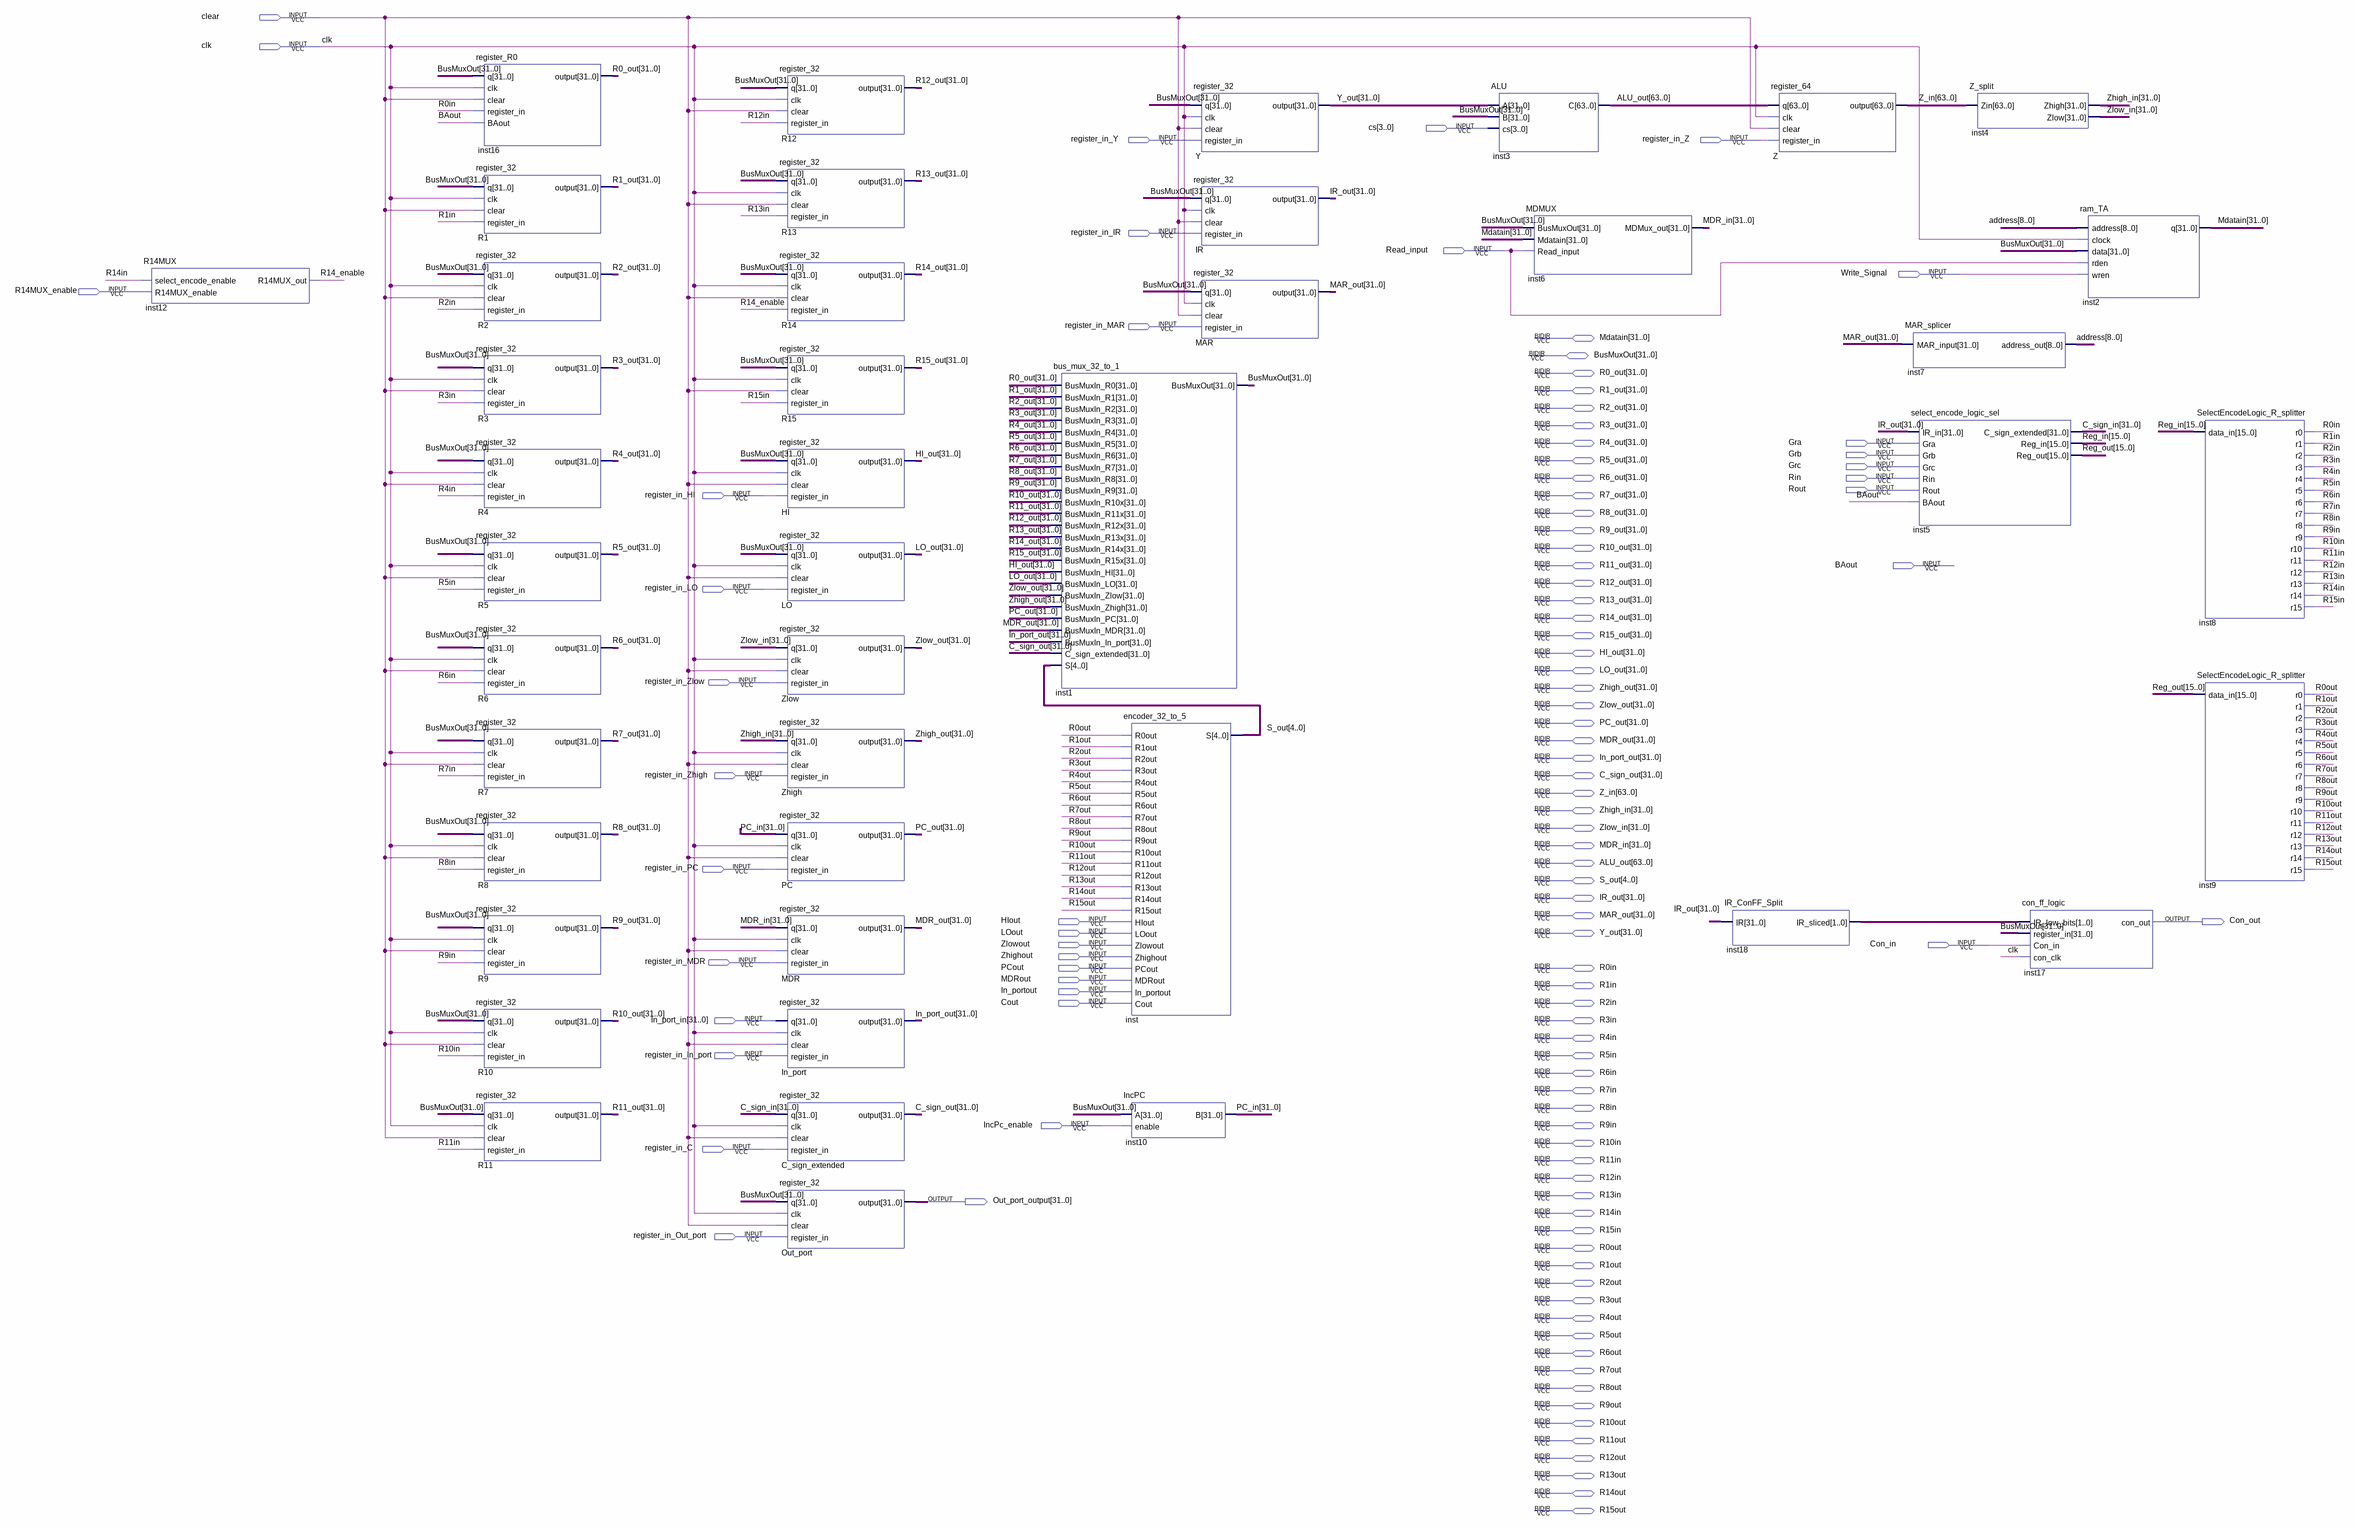
[diagram p0: schematic sheet]
// Quartus schematic phase2.bdf as structural Verilog: 43 symbols, 105 pins
module phase2 (
  input  clear,
  input  clk,
  input  [3:0] cs,
  input  register_in_Y,
  input  register_in_Z,
  input  register_in_IR,
  input  Read_input,
  input  Write_Signal,
  input  R14MUX_enable,
  input  register_in_MAR,
  input  Gra,
  input  Grb,
  input  Grc,
  input  Rin,
  input  Rout,
  input  register_in_HI,
  input  BAout,
  input  register_in_LO,
  input  register_in_Zlow,
  input  register_in_Zhigh,
  input  register_in_PC,
  input  HIout,
  input  LOout,
  input  Zlowout,
  input  Con_in,
  input  Zhighout,
  input  register_in_MDR,
  input  PCout,
  input  MDRout,
  input  In_portout,
  input  Cout,
  input  [31:0] In_port_in,
  input  register_in_In_port,
  input  IncPc_enable,
  input  register_in_C,
  input  register_in_Out_port,
  inout  [31:0] Mdatain,
  inout  [31:0] BusMuxOut,
  inout  [31:0] R0_out,
  inout  [31:0] R1_out,
  inout  [31:0] R2_out,
  inout  [31:0] R3_out,
  inout  [31:0] R4_out,
  inout  [31:0] R5_out,
  inout  [31:0] R6_out,
  inout  [31:0] R7_out,
  inout  [31:0] R8_out,
  inout  [31:0] R9_out,
  inout  [31:0] R10_out,
  inout  [31:0] R11_out,
  inout  [31:0] R12_out,
  inout  [31:0] R13_out,
  inout  [31:0] R14_out,
  inout  [31:0] R15_out,
  inout  [31:0] HI_out,
  inout  [31:0] LO_out,
  inout  [31:0] Zhigh_out,
  inout  [31:0] Zlow_out,
  inout  [31:0] PC_out,
  inout  [31:0] MDR_out,
  inout  [31:0] In_port_out,
  inout  [31:0] C_sign_out,
  inout  [63:0] Z_in,
  inout  [31:0] Zhigh_in,
  inout  [31:0] Zlow_in,
  inout  [31:0] MDR_in,
  inout  [63:0] ALU_out,
  inout  [4:0] S_out,
  inout  [31:0] IR_out,
  inout  [31:0] MAR_out,
  inout  [31:0] Y_out,
  inout  R0in,
  inout  R1in,
  inout  R2in,
  inout  R3in,
  inout  R4in,
  inout  R5in,
  inout  R6in,
  inout  R7in,
  inout  R8in,
  inout  R9in,
  inout  R10in,
  inout  R11in,
  inout  R12in,
  inout  R13in,
  inout  R14in,
  inout  R15in,
  inout  R0out,
  inout  R1out,
  inout  R2out,
  inout  R3out,
  inout  R4out,
  inout  R5out,
  inout  R6out,
  inout  R7out,
  inout  R8out,
  inout  R9out,
  inout  R10out,
  inout  R11out,
  inout  R12out,
  inout  R13out,
  inout  R14out,
  inout  R15out,
  output Con_out,
  output [31:0] Out_port_output
);

  wire R14_enable;
  wire [1:0] inst18_ir_sliced;
  wire [8:0] address;
  wire [15:0] Reg_in, Reg_out;
  wire [31:0] C_sign_in, PC_in;

  R14MUX inst12 (.select_encode_enable(R14in), .R14MUX_enable(R14MUX_enable), .R14MUX_out(R14_enable));
  register_R0 inst16 (.q(BusMuxOut), .clk(clk), .clear(clear), .register_in(R0in), .BAout(BAout), .\output (R0_out));
  register_32 R1 (.q(BusMuxOut), .clk(clk), .clear(clear), .register_in(R1in), .\output (R1_out));
  register_32 R2 (.q(BusMuxOut), .clk(clk), .clear(clear), .register_in(R2in), .\output (R2_out));
  register_32 R3 (.q(BusMuxOut), .clk(clk), .clear(clear), .register_in(R3in), .\output (R3_out));
  register_32 R4 (.q(BusMuxOut), .clk(clk), .clear(clear), .register_in(R4in), .\output (R4_out));
  register_32 R5 (.q(BusMuxOut), .clk(clk), .clear(clear), .register_in(R5in), .\output (R5_out));
  register_32 R6 (.q(BusMuxOut), .clk(clk), .clear(clear), .register_in(R6in), .\output (R6_out));
  register_32 R7 (.q(BusMuxOut), .clk(clk), .clear(clear), .register_in(R7in), .\output (R7_out));
  register_32 R8 (.q(BusMuxOut), .clk(clk), .clear(clear), .register_in(R8in), .\output (R8_out));
  register_32 R9 (.q(BusMuxOut), .clk(clk), .clear(clear), .register_in(R9in), .\output (R9_out));
  register_32 R10 (.q(BusMuxOut), .clk(clk), .clear(clear), .register_in(R10in), .\output (R10_out));
  register_32 R11 (.q(BusMuxOut), .clk(clk), .clear(clear), .register_in(R11in), .\output (R11_out));
  register_32 R12 (.q(BusMuxOut), .clk(clk), .clear(clear), .register_in(R12in), .\output (R12_out));
  register_32 R13 (.q(BusMuxOut), .clk(clk), .clear(clear), .register_in(R13in), .\output (R13_out));
  register_32 R14 (.q(BusMuxOut), .clk(clk), .clear(clear), .register_in(R14_enable), .\output (R14_out));
  register_32 R15 (.q(BusMuxOut), .clk(clk), .clear(clear), .register_in(R15in), .\output (R15_out));
  register_32 HI (.q(BusMuxOut), .clk(clk), .clear(clear), .register_in(register_in_HI), .\output (HI_out));
  register_32 LO (.q(BusMuxOut), .clk(clk), .clear(clear), .register_in(register_in_LO), .\output (LO_out));
  register_32 Zlow (.q(Zlow_in), .clk(clk), .clear(clear), .register_in(register_in_Zlow), .\output (Zlow_out));
  register_32 Zhigh (.q(Zhigh_in), .clk(clk), .clear(clear), .register_in(register_in_Zhigh), .\output (Zhigh_out));
  register_32 PC (.q(PC_in), .clk(clk), .clear(clear), .register_in(register_in_PC), .\output (PC_out));
  register_32 MDR (.q(MDR_in), .clk(clk), .clear(clear), .register_in(register_in_MDR), .\output (MDR_out));
  register_32 In_port (
    .clear(clear), .clk(clk), .q(In_port_in), .register_in(register_in_In_port), .\output (In_port_out));
  register_32 C_sign_extended (
    .clear(clear), .clk(clk), .q(C_sign_in), .register_in(register_in_C), .\output (C_sign_out));
  register_32 Out_port (
    .q(BusMuxOut), .clk(clk), .clear(clear), .register_in(register_in_Out_port), .\output (Out_port_output));
  bus_mux_32_to_1 inst1 (
    .BusMuxIn_R0(R0_out), .BusMuxIn_R1(R1_out), .BusMuxIn_R2(R2_out), .BusMuxIn_R3(R3_out),
    .BusMuxIn_R4(R4_out), .BusMuxIn_R5(R5_out), .BusMuxIn_R6(R6_out), .BusMuxIn_R7(R7_out),
    .BusMuxIn_R8(R8_out), .BusMuxIn_R9(R9_out), .BusMuxIn_R10x(R10_out), .BusMuxIn_R11x(R11_out),
    .BusMuxIn_R12x(R12_out), .BusMuxIn_R13x(R13_out), .BusMuxIn_R14x(R14_out), .BusMuxIn_R15x(R15_out),
    .BusMuxIn_HI(HI_out), .BusMuxIn_LO(LO_out), .BusMuxIn_Zlow(Zlow_out), .BusMuxIn_Zhigh(Zhigh_out),
    .BusMuxIn_PC(PC_out), .BusMuxIn_MDR(MDR_out), .BusMuxIn_In_port(In_port_out),
    .C_sign_extended(C_sign_out), .S(S_out), .BusMuxOut(BusMuxOut));
  encoder_32_to_5 inst (
    .R0out(R0out), .R1out(R1out), .R2out(R2out), .R3out(R3out), .R4out(R4out), .R5out(R5out), .R6out(R6out),
    .R7out(R7out), .R8out(R8out), .R9out(R9out), .R10out(R10out), .R11out(R11out), .R12out(R12out),
    .R13out(R13out), .R14out(R14out), .R15out(R15out), .HIout(HIout), .LOout(LOout), .Zlowout(Zlowout),
    .Zhighout(Zhighout), .PCout(PCout), .MDRout(MDRout), .In_portout(In_portout), .Cout(Cout), .S(S_out));
  IncPC inst10 (.A(BusMuxOut), .enable(IncPc_enable), .B(PC_in));
  register_32 Y (.q(BusMuxOut), .clk(clk), .clear(clear), .register_in(register_in_Y), .\output (Y_out));
  register_32 IR (.clear(clear), .clk(clk), .q(BusMuxOut), .register_in(register_in_IR), .\output (IR_out));
  register_32 MAR (.clear(clear), .clk(clk), .q(BusMuxOut), .register_in(register_in_MAR), .\output (MAR_out));
  ALU inst3 (.A(Y_out), .B(BusMuxOut), .cs(cs), .C(ALU_out));
  MDMUX inst6 (.BusMuxOut(BusMuxOut), .Mdatain(Mdatain), .Read_input(Read_input), .MDMux_out(MDR_in));
  IR_ConFF_Split inst18 (.IR(IR_out), .IR_sliced(inst18_ir_sliced));
  register_64 Z (.q(ALU_out), .clk(clk), .clear(clear), .register_in(register_in_Z), .\output (Z_in));
  MAR_splicer inst7 (.MAR_input(MAR_out), .address_out(address));
  select_encode_logic_sel inst5 (
    .IR_in(IR_out), .Gra(Gra), .Grb(Grb), .Grc(Grc), .Rin(Rin), .Rout(Rout), .BAout(BAout),
    .C_sign_extended(C_sign_in), .Reg_in(Reg_in), .Reg_out(Reg_out));
  Z_split inst4 (.Zin(Z_in), .Zhigh(Zhigh_in), .Zlow(Zlow_in));
  con_ff_logic inst17 (
    .IR_low_bits(inst18_ir_sliced), .register_in(BusMuxOut), .Con_in(Con_in), .con_clk(clk), .con_out(Con_out));
  ram_TA inst2 (.address(address), .clock(clk), .data(BusMuxOut), .rden(Read_input), .wren(Write_Signal), .q(Mdatain));
  SelectEncodeLogic_R_splitter inst8 (
    .data_in(Reg_in), .r0(R0in), .r1(R1in), .r2(R2in), .r3(R3in), .r4(R4in), .r5(R5in), .r6(R6in), .r7(R7in),
    .r8(R8in), .r9(R9in), .r10(R10in), .r11(R11in), .r12(R12in), .r13(R13in), .r14(R14in), .r15(R15in));
  SelectEncodeLogic_R_splitter inst9 (
    .data_in(Reg_out), .r0(R0out), .r1(R1out), .r2(R2out), .r3(R3out), .r4(R4out), .r5(R5out), .r6(R6out),
    .r7(R7out), .r8(R8out), .r9(R9out), .r10(R10out), .r11(R11out), .r12(R12out), .r13(R13out), .r14(R14out),
    .r15(R15out));
endmodule
